# EAGLE design BNO055 (EAGLE 8.6.0)
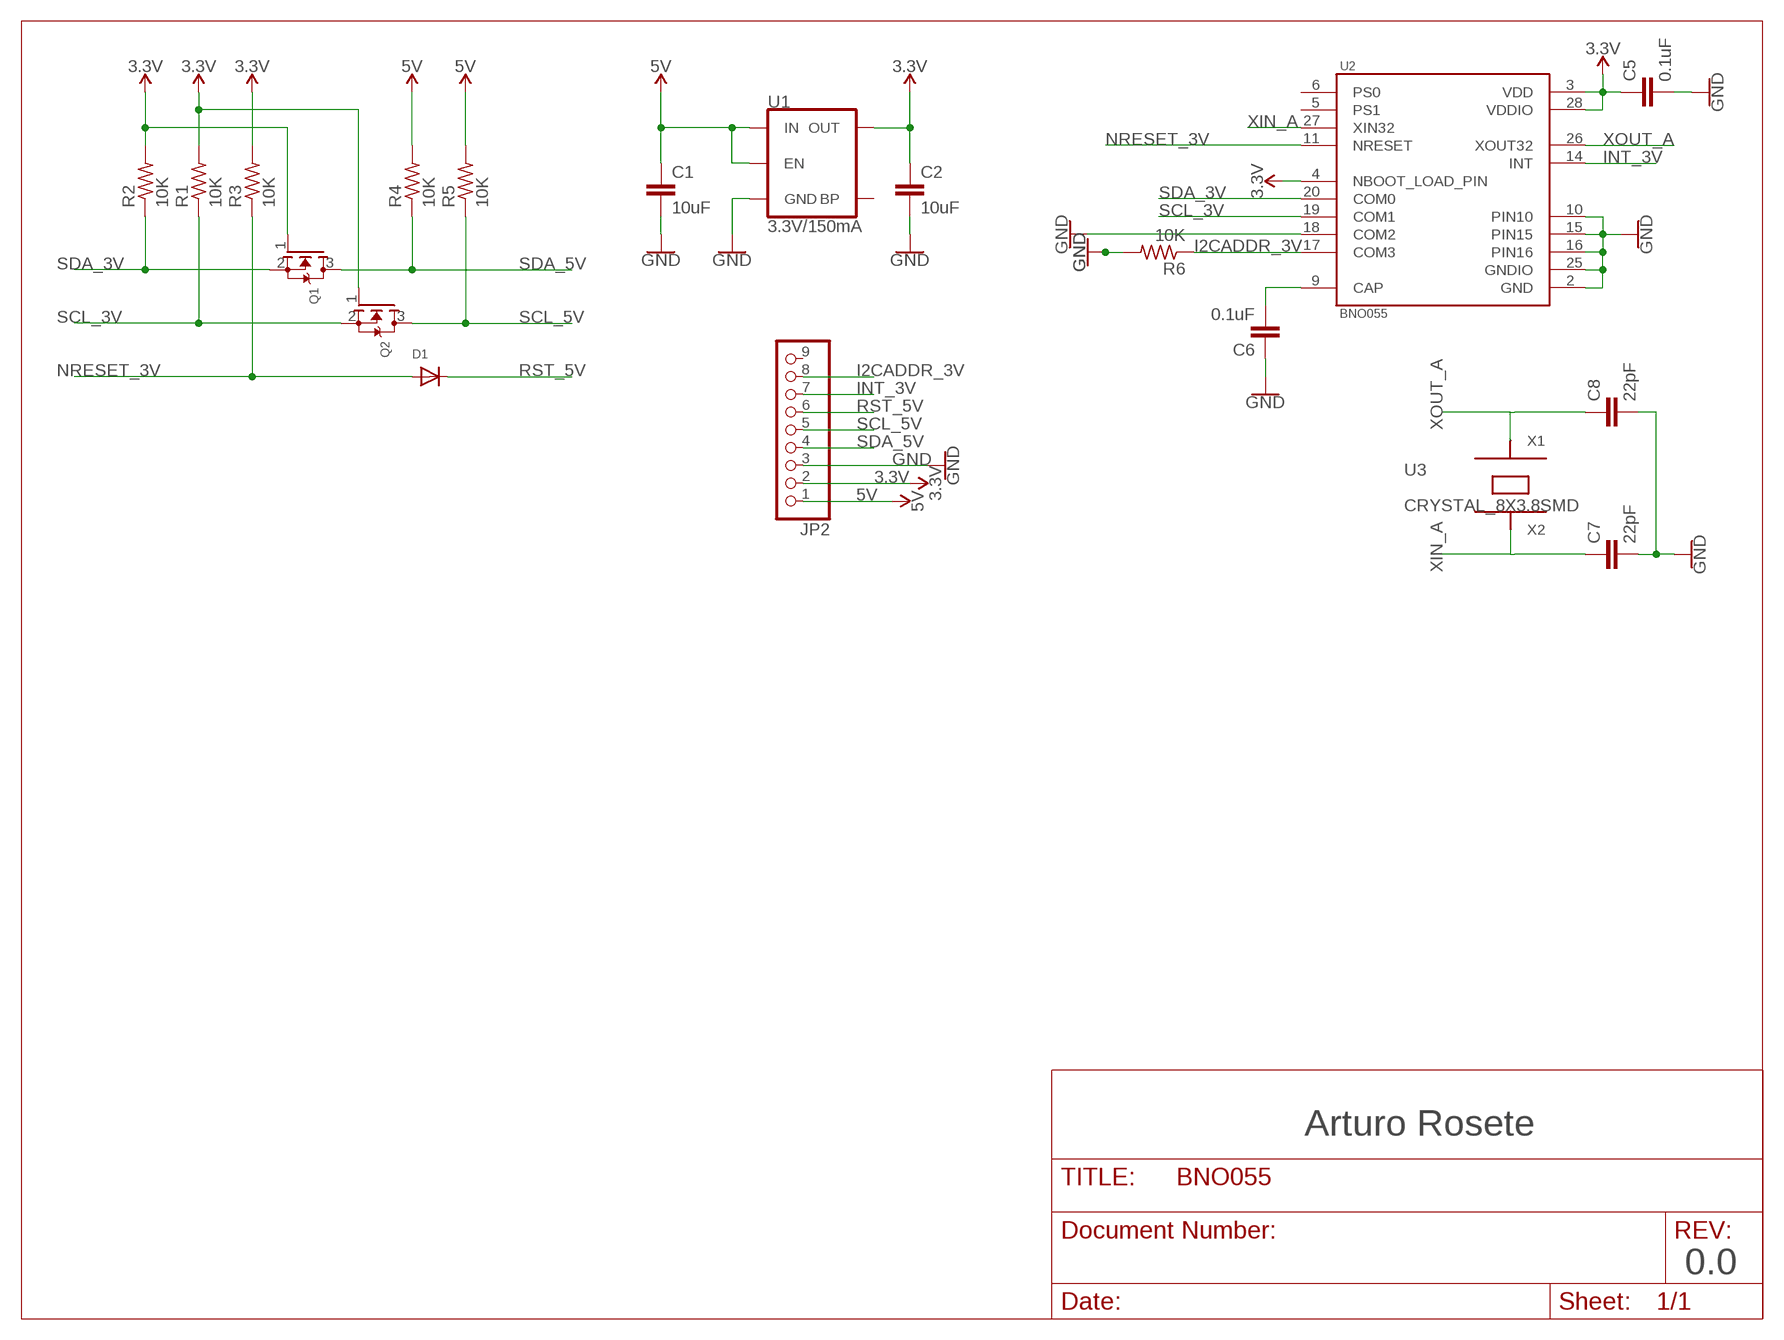
[diagram p0: schematic, sheet 1]

## Parts
C1  10uF  10UF-0805-10V-10%  [0805]
C2  10uF  10UF-0805-10V-10%  [0805]
C5  0.1uF  C-EUC0805  [C0805]
C6  0.1uF  C-EUC0805  [C0805]
C7  22pF  C-EUC0805  [C0805]
C8  22pF  C-EUC0805  [C0805]
D1  DIODESOD-323F  [SOD-323F]
JP2  PINHD-1X9  [1X09-BIG]
Q1  MOSFET-NWAVE  [SOT23-W]
Q2  MOSFET-NWAVE  [SOT23-W]
R1  10K  R-US_R0805  [R0805]
R2  10K  R-US_R0805  [R0805]
R3  10K  R-US_R0805  [R0805]
R4  10K  R-US_R0805  [R0805]
R5  10K  R-US_R0805  [R0805]
R6  10K  R-US_R0805  [R0805]
U1  3.3V/150mA  V_REG_MIC52053.3V  [SOT23-5]
U2  BNO055  [LGA28R50P4X10_380X520X100]
U3  CRYSTAL_8X3.8SMD  [PM8.0X3.8MM]

## Nets
3.3V: C2.1 C5.1 JP2.2 Q1.1(G) Q2.1(G) R1.2 R2.2 R3.2 U1.5(OUT) U2.3(VDD) U2.4(NBOOT_LOAD_PIN) U2.28(VDDIO)
5V: C1.1 JP2.1 R4.2 R5.2 U1.1(IN) U1.3(EN)
GND: C1.2 C2.2 C5.2 C6.1 C7.2 C8.2 JP2.3 R6.2 U1.2(GND) U2.2(GND) U2.10(PIN10) U2.15(PIN15) U2.16(PIN16) U2.18(COM2) U2.25(GNDIO)
I2CADDR_3V: JP2.8 R6.1 U2.17(COM3)
INT_3V: JP2.7 U2.14(INT)
N$3: C6.2 U2.9(CAP)
NRESET_3V: D1.A R3.1 U2.11(NRESET)
RST_5V: D1.C JP2.6
SCL_3V: Q2.2(S) R1.1 U2.19(COM1)
SCL_5V: JP2.5 Q2.3(D) R5.1
SDA_3V: Q1.2(S) R2.1 U2.20(COM0)
SDA_5V: JP2.4 Q1.3(D) R4.1
XIN_A: C7.1 U2.27(XIN32) U3.4(X2)
XOUT_A: C8.1 U2.26(XOUT32) U3.1(X1)
Unconnected: JP2.9 U1.4(BP) U2.5(PS1) U2.6(PS0)

## Notes on the sheet
- Arturo Rosete
- 0.0

## Library data of the parts
C1 C2 = SparkFun-Capacitors:10UF: 10.0µF ceramic capacitors A capacitor is a passive two-terminal electrical component used to store electrical energy temporarily in an electric field.; PROD_ID: CAP-11330
C5-C8 = rcl:C-EU: CAPACITOR, European symbol; SPICEPREFIX: C
D1 = adafruit:DIODE: Diode SMADIODE - SMA Surface Mount Package 20V 1A Schottky Diode Digikey: 641-1014-6-ND DO-1N4148 - Through Hole Small Current Diode SOD-123 20V 1 A (.5mV Vf) Schottky Diode - Digikey: MBRX120TPMSCT-ND SOD-323 10V 570mA (.38mV Vf, 3ns) Schottky Diode - Digikey: ZLLS410CT-ND SOD-523 30V 30mA Schottky Diode (RB751S-40TE61) - Digikey: RB751S-40TE61CT-ND SOT23-R/W - SOT23 Package (R = Solder Paste/Reflow Ovens, W = Hand-Soldering) BAT54Film 40V 300mA - Digikey: 497-7162-1-ND
JP2 = adafruit:PINHD-1X9: Pin header 1x10 0.1" spacing With round pins
Q1 Q2 = adafruit:MOSFET-N: N-Channel Mosfet 2N7002E - 60V 260mA SOT23 [Digikey: 2N7002ET1GOSTR-ND] - REEL BSH103 - 30V 850mA SOT23 [Digikey: 568-5013-1-ND]
R1-R6 = adafruit:R-US_: RESISTOR, American symbol
U1 = SparkFun-IC-Power:V_REG_MIC5205: V_REG MIC5205 Standard 3.3V, 5V, and Adjustable 150mA LDO voltage regulator in SOT-23 layout. Micrel part MIC5205. BP (by-pass) pin is used to lower output noise with 470pF cap, may be left open. On the adjustable version BP is used to set output.; PROD_ID: VREG-00822
U2 = BNO055:BNO055: BNO055 9-axis Absolute Orientation Sensor ( SiP ) w/Sensors and Sensor Fusion; DESCRIPTION: IMU ACCEL/GYRO/MAG I2C 28LGA; DIGI-KEY_PART_NUMBER: 828-1058-1-ND; DIGI-KEY_PURCHASE_URL: https://www.digikey.com.mx/product-detail/en/bosch-sensortec/BNO055/828-1058-1-ND/6136309?WT.z_cid=ref_snapeda&utm_source=snapeda&utm_medium=aggregator&utm_campaign=buynow; MF: Bosch; MP: BNO055; PACKAGE: LGA-28 Bosch
U3 = hygiea_parts:CRYSTAL_8X3.8: Description: Cristal oscilador necesario para el sensor BNO055 de Bosch.

## Board
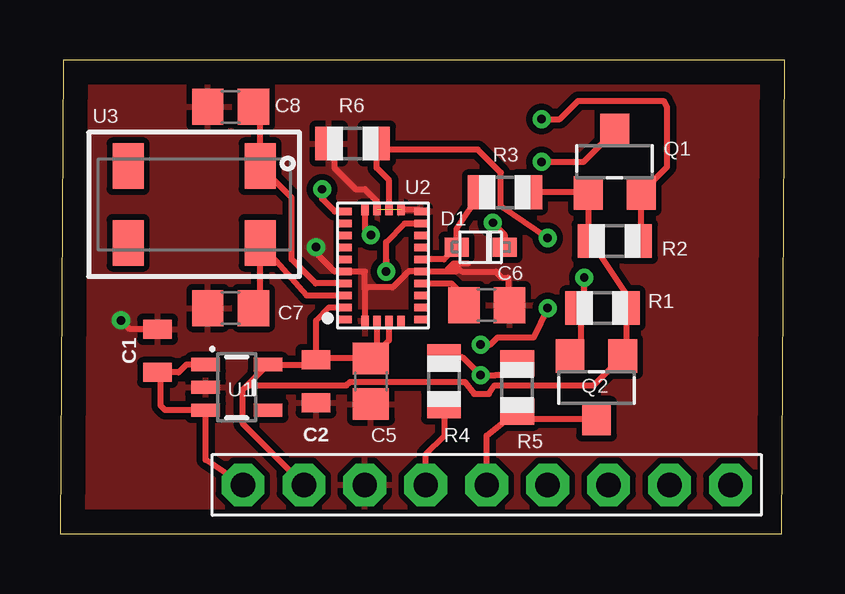
[diagram p1: board, top side]
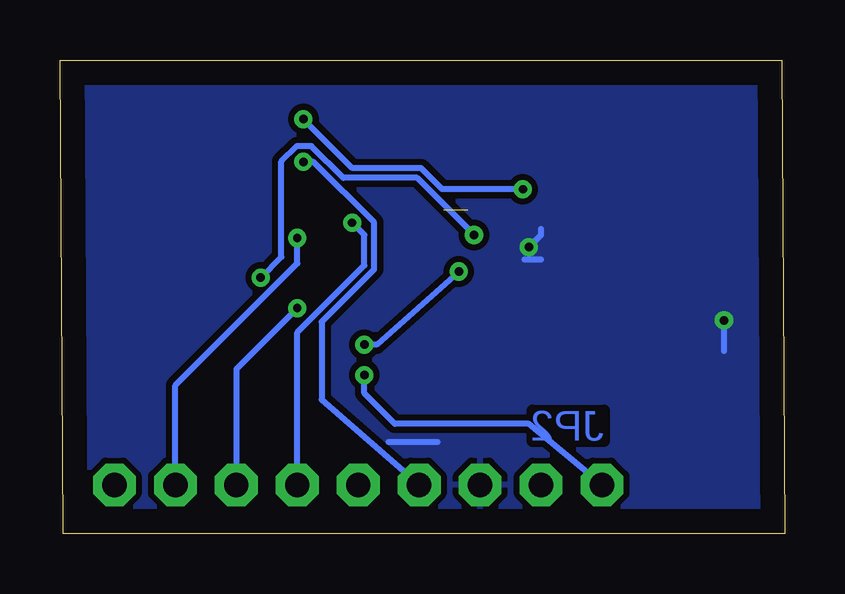
[diagram p2: board, bottom side, seen from below]

Size 30.21 x 19.74 mm. Coordinates in mm from the lower left corner, seen from the top.
Outline: 0,0 30.08,0 30.21,19.74 0.13,19.74 0,0
Copper layers (1*16): Top 0.035mm / dielectric 1.5mm / Bottom 0.035mm
Design rules "default": minimum track width 6mil, minimum drill 0.35mm, track to track 6mil, track to pad 6mil, pad to pad 6mil, via to via 6mil, smd to smd 6mil, copper to edge 40mil, drill to drill 6mil, minimum pad ring 10mil, minimum via ring 8mil, stop-mask expansion 4mil, vias tented up to drill 0mil, thermal gap 10mil

### Footprints (pad centres in the part's own frame; a part is rotated, then mirrored left to right if it is on the bottom)
0805 = smd 0.8 x 1.2: 1 -0.9,0; 2 0.9,0
C0805 = smd 1.3 x 1.5: 1 -0.95,0; 2 0.95,0
SOD-323F = smd 1 x 0.8: A -1,0; C 1,0
1X09-BIG = drill 1.016 pad 1.778 octagon: 1 -10.16,0; 2 -7.62,0; 3 -5.08,0; 4 -2.54,0; 5 0,0; 6 2.54,0; 7 5.08,0; 8 7.62,0; 9 10.16,0
SOT23-W = smd 1.2 x 1.4: 1 -1.1,-1.3; 2 1.1,-1.3; 3 0,1.3
R0805 = smd 1.1 x 1.4: 1 -1,0; 2 1,0
SOT23-5 = smd 0.55 x 1.2: 1 -0.95,-1.3; 2 0,-1.3; 3 0.95,-1.3; 4 0.95,1.3; 5 -0.95,1.3
LGA28R50P4X10_380X520X100 = smd 0.3 x 0.525: 1 -2.25,1.562; 6 -2.25,-1.562; 7 -1.75,-1.562; 8 -1.25,-1.562; 9 -0.75,-1.562; 10 -0.25,-1.562; 11 0.25,-1.562; 12 0.75,-1.562; 13 1.25,-1.562; 14 1.75,-1.562; 15 2.25,-1.562; 20 2.25,1.562; 21 1.75,1.562; 22 1.25,1.562; 23 0.75,1.562; 24 0.25,1.562; 25 -0.25,1.562; 26 -0.75,1.562; 27 -1.25,1.562; 28 -1.75,1.562 | smd 0.425 x 0.3: 2 -2.312,0.75; 3 -2.312,0.25; 4 -2.312,-0.25; 5 -2.312,-0.75; 16 2.312,-0.75; 17 2.312,-0.25; 18 2.312,0.25; 19 2.312,0.75
PM8.0X3.8MM = smd 1.3 x 1.9: 1 -2.75,-1.6; 2 2.75,-1.6; 3 2.75,1.6; 4 -2.75,1.6

### Placement (x,y rotation side)
C1  4.06,7.62 90 top
C2  10.67,6.35 270 top
C5  12.95,6.35 270 top
C6  17.78,9.53 180 top
C7  7.11,9.4 180 top
C8  7.11,17.78 180 top
D1  17.53,11.94 0 top
JP2  17.78,2.03 0 top
Q1  23.11,15.49 0 top
Q2  22.35,6.1 180 top
R1  22.61,9.4 0 top
R2  23.11,12.19 180 top
R3  18.54,14.22 0 top
R4  16,6.35 90 top
R5  19.05,6.1 90 top
R6  12.19,16.26 180 top
U1  7.37,6.1 270 top
U2  13.46,11.18 90 top
U3  5.59,13.72 180 top

### Tracks (layer width: path | path; a pad name or v marks a point on that pad's centre or on a via)
3.3V
  Top 0.254: C5.1 13.21,7.56 U2.3 | C5.1 13.71,8.06 U2.4 | C5.1 10.72,7.3 C2.1 | C2.1 10.46,7.05 U1.5 7.79,6.17 | JP2.2 7.62,4.57 7.62,6 7.79,6.17 | 7.79,6.17 11.93,6.17 12.09,6.33 16.87,6.33 17.25,5.82 17.87,5.82 18.11,6.18 22.23,6.18 Q2.1 23.61,7.55 R1.2 23.61,9.94 R2.2 22.01,11.84 Q1.1 21.98,14.22 R3.2 | C2.1 10.67,8.89 11.2,9.43 U2.28
5V  (via drill 0.35)
  Top 0.254: R4.2 16.78,7.35 v17.53,6.6 18.15,6.6 18.16,6.61 18.57,6.61 R5.2 | JP2.1 6.07,3.08 U1.3 4.38,5.15 4.19,5.33 4.19,6.59 C1.1 4.94,6.72 5.27,7.05 U1.1
  Bottom 0.254: v17.53,6.6 17.53,5.84 16.26,4.57 10.67,4.57 JP2.1
GND  (via drill 0.35)  (1 unrouted)
  Top 0.254: C1.2 2.91,8.52 v2.54,8.89 | U2.15 14.96,13.49 U2.16 | 10.85,11.94 v10.67,11.94 10.67,11.69 11.43,10.93 U2.25 12.7,10.93 12.7,10.16 12.71,10.16 | 16.14,11 16.41,11.26 | 16.41,11.26 16.51,11.26 | 16.51,11.26 17,11.26 | U2.2 12.71,10.16 | 16.51,11.26 16.51,10.93 U2.10 14.52,10.93 13.86,10.26 12.82,10.26 12.71,10.16 | R6.2 11.43,16.02 11.43,15.24 12.32,14.35 12.7,14.35 13.21,13.84 U2.18 | 16.41,11.26 16.74,10.92 18.16,10.92 18.41,10.67 18.67,10.67 18.67,9.59 C6.1
  Bottom 0.254: v2.54,8.89 2.54,7.62 | 10.85,11.43 10.16,11.43 | v10.67,11.94 10.16,12.45 10.16,12.7 | 14.48,3.81 16.51,3.81
  pour Top (isolate 0.254): 0,0 30.23,0 30.23,19.68 0,19.68
  pour Bottom (isolate 0.254): 0,0 30.23,0.13 30.23,19.94 0,19.81
I2CADDR_3V  (via drill 0.35)
  Top 0.254: v20.32,12.32 18.37,13.63 18.37,15.04 17.41,16 13.73,16 R6.1 13.19,15.24 13.71,14.72 U2.17
  Bottom 0.254: JP2.8 25.4,6.18 20.32,11.26 v20.32,12.32
INT_3V  (via drill 0.35)
  Top 0.254: v20.32,9.4 19.74,8.18 18.23,8.18 17.93,7.87 v17.53,7.87 | 13.59,11.43 v13.59,10.92 13.59,12.15 14.36,12.93 U2.14
  Bottom 0.254: v13.59,10.92 17.02,7.87 v17.53,7.87 | v20.32,9.4 22.86,6.86 JP2.7
N$3
  Top 0.254: C6.2 16.56,10.17 16.31,10.43 U2.9
NRESET_3V
  Top 0.254: U2.11 16,11.43 16.51,11.94 D1.A 16.53,12.7 R3.1
RST_5V  (via drill 0.35)
  Top 0.254: v18.03,12.95 18.53,12.46 D1.C
  Bottom 0.254: v18.03,12.95 17.53,12.45 17.53,11.18 20.32,8.38 JP2.6
SCL_3V  (via drill 0.35)
  Top 0.254: R1.1 21.73,9.52 | 21.73,9.52 21.84,9.64 v21.84,10.67 | v12.95,12.45 12.71,12.69 U2.19 | Q2.2 21.73,7.87 21.73,9.52
  Bottom 0.254: v21.84,10.67 20.98,11.53 20.98,15.51 20.34,16.15 19.73,16.15 18.39,14.82 15.33,14.82 v12.95,12.45
SCL_5V
  Top 0.254: Q2.3 19.6,4.8 R5.1 17.78,4.08 JP2.5
SDA_3V  (via drill 0.35)
  Top 0.254: R2.1 24.21,12.04 Q1.2 25.3,15.28 25.3,17.73 25.15,18.03 21.59,18.03 20.83,17.27 v20.07,17.27 | U2.20 11.45,13.43 10.92,13.95 v10.92,14.35
  Bottom 0.254: v20.07,17.27 18.02,15.23 15.16,15.23 14.28,14.35 v10.92,14.35
SDA_5V  (via drill 0.35)
  Top 0.254: R4.1 16,4.06 15.24,3.3 JP2.4 | v20.07,15.49 21.81,15.49 Q1.3
  Bottom 0.254: JP2.4 19.3,5.59 19.3,8.82 17.12,11.01 17.12,12.97 19.64,15.49 v20.07,15.49
XIN_A
  Top 0.254: C7.1 8.34,9.67 U3.4 10.27,9.93 U2.27
XOUT_A
  Top 0.254: C8.1 8.34,17.5 U3.1 9.65,14 9.65,11.43 10.66,10.43 U2.26